# Altium schematic sheet ble_seismometer.SchDoc
size A; SheetNumber: 1; SheetTotal: 1
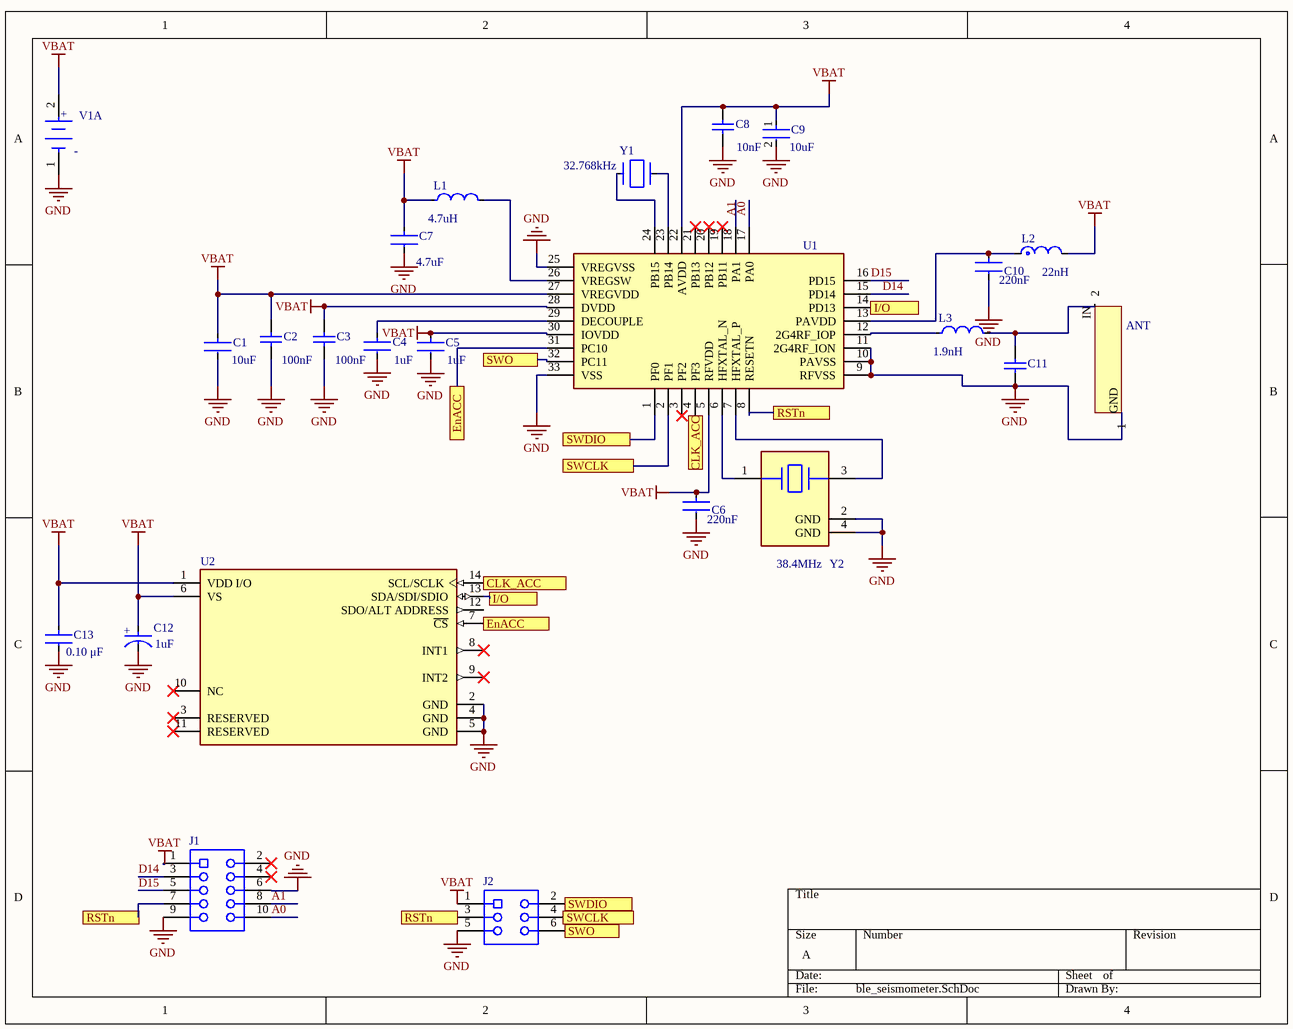
[diagram p0: ble_seismometer.SchDoc]

## Parts
ANT  Inverted F Antenna  [InvertedF-FOOTPRINT]  (value not drawn)  (net tie, no BOM)
C1  Capacitance: 10uF  [FP-C1608-080-0_1-MFG]  (hidden comment: C1608X5R1A106K080AC)
C2  Capacitance: 100nF  [CAPC1608X90X35ML10T15]  (hidden comment: GRM188R71H104KA93D)
C3  Capacitance: 100nF  [CAPC1608X90X35ML10T15]  (hidden comment: GRM188R71H104KA93D)
C4  Capacitance: 1uF  [FP-C0402C105K8PACTU-MFG]  (hidden comment: C0402C105K8PACTU)
C5  Capacitance: 1uF  [FP-C0402C105K8PACTU-MFG]  (hidden comment: C0402C105K8PACTU)
C6  Capacitance: 220nF  [FP-GRM188-0_1-e0_2_0_5-IPC_C]  (hidden comment: GRM188R71E224KA88D)
C7  Capacitance: 4.7uF  [FP-GRM188-0_1-MFG]  (hidden comment: GRM188R60J475KE19D)
C8  Capacitance: 10nF  [CAPC1608X90X35ML10T15]  (hidden comment: GRM188R71H103KA01D)
C9  Capacitance: 10uF  [FP-GRM188-0_1-e0_2_0_55-IPC_A]  (hidden comment: GRM188R60J106ME47D)
C10  Capacitance: 220nF  [FP-GRM188-0_1-e0_2_0_5-IPC_C]  (hidden comment: GRM188R71E224KA88D)
C11  VJ0603D1R5BXPAJ  [CAPC1608X92X38ML15T08]  (value not drawn)
C12  value 1uF  [FP-F98M-MFG]  (hidden comment: F981E105MMA)
C13  value 0.10 μF  [FP-C0603C-CF-MFG]  (hidden comment: C0603C104K5RACTU)
J1  61301021821  [61301021821]  (value not drawn)
J2  62000621821  [62000621821]  (value not drawn)
L1  Inductance: 4.7uH  [FP-LQM18FN_00-IPC_A]  (hidden comment: LQM18FN4R7M00D)
L2  Inductance: 22nH  [FP-LQG18HH_00-IPC_C]  (hidden comment: LQG18HN22NJ00D)
L3  Inductance: 1.9nH  [FP-LQW03AW_00-MFG]  (hidden comment: LQW03AW1N9C00D)
U1  EFR32BG13P632F512GM32-D  [EFR32BG13P632F512GM32-D]  (value not drawn)
U2  ADXL345BCCZ-RL7  [FP-CC-14-1-MFG]  (value not drawn)
V1  1013  [FP-1013-MFG]  (value not drawn)  (part A of 2)
Y1  Frequency: 32.768kHz  [FP-ABS05-MFG]  (hidden comment: ABS05-32.768KHZ-T)
Y2  Frequency: 38.4MHz  [FP-ABM10-165-MFG]  (hidden comment: ABM10-165-38.400MHZ-T3)

## Ports
CLK_ACC (see ble_seismometer[2C]), CLK_ACC (see ble_seismometer[3B]), EnACC (see ble_seismometer[2B]), EnACC (see ble_seismometer[2C]), I/O (see ble_seismometer[2C]), I/O (see ble_seismometer[3B]), RSTn (see ble_seismometer[1D], ble_seismometer[2D]), RSTn (see ble_seismometer[1D], ble_seismometer[3B]), RSTn (see ble_seismometer[2D], ble_seismometer[3B]), SWCLK (see ble_seismometer[2B]), SWCLK (see ble_seismometer[2D]), SWDIO (see ble_seismometer[2B]), SWDIO (see ble_seismometer[2D]), SWO (see ble_seismometer[2B]), SWO (see ble_seismometer[2D])

## Nets
GND: ANT.GND(1) C1.1 C2.1 C3.1 C4.2 C5.2 C6.2 C7.1 C8.1 C9.2 C10.2 C11.1 C12.1(C) C13.2 J1.6 J1.9 J2.5 U1.9(RFVSS) U1.10(PAVSS) U1.11(2G4RF_ION) U1.25(VREGVSS) U1.33(VSS) U2.2(GND) U2.4(GND) U2.5(GND) V1.1(1_CATHODE) Y2.2(GND) Y2.4(GND)
VBAT: C1.2 C2.2 C3.2 C5.1 C6.1 C7.2 C8.2 C9.1 C12.2(A) C13.1 J1.1 J2.1 L1.1 L2.2 U1.5(RFVDD) U1.22(AVDD) U1.27(VREGVDD) U1.28(DVDD) U1.30(IOVDD) U2.1(VDD_I/O) U2.6(VS) V1.2(1_ANODE)
A0: J1.10 U1.17(PA0)
A1: J1.8
CLK_ACC: U1.4(PF3) U2.14(SCL/SCLK) ; port CLK_ACC
D14: J1.3 U1.15(PD14)
D15: J1.5 U1.16(PD15)
EnACC: U1.31(PC10) U2.7(~{CS}) ; port EnACC
I/O: U1.14(PD13) U2.13(SDA/SDI/SDIO) ; port I/O
RSTn: J2.3 U1.8(RESETN) ; port RSTn
SWCLK: U1.2(PF1) ; port SWCLK
SWDIO: J2.2 U1.1(PF0) ; port SWDIO
SWO: J2.6 U1.32(PC11) ; port SWO
NetANT_IN: ANT.IN(2) C11.2 L3.2
NetC4_1: C4.1 U1.29(DECOUPLE)
NetC10_1: C10.1 L2.1 U1.13(PAVDD)
NetL1_2: L1.2 U1.26(VREGSW)
NetL3_1: L3.1 U1.12(2G4RF_IOP)
NetU1_6: U1.6(HFXTAL_N) Y2.1(1_Crystal)
NetU1_7: U1.7(HFXTAL_P) Y2.3(2_Crystal)
NetU1_23: U1.23(PB14) Y1.2
NetU1_24: U1.24(PB15) Y1.1

Not connected (* = marked no-connect by the designer): J1 2* 4* 7; J2 4; U1 3(PF2)* 18(PA1) 19(PB11)* 20(PB12)* 21(PB13)*; U2 3(RESERVED)* 8(INT1)* 9(INT2)* 10(NC)* 11(RESERVED)* 12(SDO/ALT_ADDRESS)

## Notes on the sheet
- Labels drawn without touching a wire or pin: A1
- (in symbol CMP-04424-000025-1) +
- (in symbol CMP-19636-000024-1, part A) +

## Library data of the parts
ANT = InvertedF
C1 = CMP-2000-04979-3: Multilayer Ceramic Capacitors 10μF ±10% 10V X5R SMD 0603; Dielectric Material: Ceramic; Construction: Flat; Height: 0.8mm; Thickness: 0.035inch; Case Code (Metric): 1608; Radiation Hardening: No; Number of Pins: 2; Voltage Rating (DC): 10V; Depth: 0.8mm; Voltage: 10V; RoHS Compliant: Yes; Voltage Rating: 10V; Package Quantity: 1; Resistor Type: Ceramic; Termination: SMD/SMT; Lead Free: Lead Free; REACH SVHC: No SVHC; Tolerance: 10%; Mount: Surface Mount; Series: C; Packaging: Tape and Reel; Width: 0.8mm; Dielectric: X5R; Weight: 7.1E-05oz; Length: 1.6mm; Max Operating Temperature: 85°C; Case Code (Imperial): 0603; Case/Package: 0603; Min Operating Temperature: -55°C
C2 C3 = CMP-2100-03643-1: Chip Capacitor, 0.1 uF, +/- 10%, 50 V, -55 to 125 degC, 0603 (1608 Metric), RoHS, Tape and Reel; Manufacturer: Murata; Dielectric Material: Ceramic; Voltage Rating: 50V; Dielectric: X7R; Insulation Resistance: 10GR; Case Code (Metric): 1608; Lead Free: LeadFree; Depth: 0.8mm; Number of Pins: 2; Radiation Hardening: No; Case/Package: 0603; Manufacturer URL: http://www.murata.com/; Packaging: TapeandReel; Length: 1.6mm; Contact Plating: Tin; Datasheet URL: http://psearch.en.murata.com/capacitor/product/GRM188R71H104KA93%23.pdf; Tolerance: 10%; Case Code (Imperial): 0603; Min Operating Temperature: -55degC; RoHSCompliant: true; Voltage: 50V; Termination: SMD/SMT; Mount: SurfaceMount; Material: Ceramic; Package Quantity: 1; Height: 0.8mm; Thickness: 0.035inch; REACH SVHC: NoSVHC; Max Operating Temperature: 125degC; Width: 0.8mm; Package Reference: 0603; Voltage Rating (DC): 50V; Datasheet Version: 42675.0; Package Description: 2-Pin Surface Mount Device, Body 1.6 x 0.8 mm
C4 C5 = CMP-2008-02081-2: CAP CER 1UF 10V X5R 0402; Dielectric Material: Ceramic; Dissipation Factor: 5%; Tolerance: 10%; Number of Pins: 2; Contact Plating: Tin; Min Operating Temperature: -55°C; Termination: SMD/SMT; Lead Free: Lead Free; Construction: Flat; Voltage Rating (DC): 10V; Mount: Surface Mount; Series: C; Thickness: 0.022inch; Width: 0.5mm; Radiation Hardening: No; Dielectric: X5R; Height: 0.5mm; Voltage: 10V; Length: 1mm; Depth: 0.5mm; Max Operating Temperature: 85°C; Package Quantity: 1; Packaging: Tape and Reel; RoHS Compliant: Yes; Case Code (Imperial): 0402; Case Code (Metric): 1005; REACH SVHC: No SVHC; Voltage Rating: 10V; Case/Package: 0402
C6 C10 = CMP-1035-02648-3: Chip Multilayer Ceramic Capacitors for General Purpose, 0603, 0.22uF, X7R, 15%, 10%, 25V; Voltage: 50V; Number of Pins: 2; Length: 1.6mm; Material: Ceramic; Depth: 0.8mm; REACH SVHC: No SVHC; Voltage Rating (DC): 25V; Tolerance: 10%; Max Operating Temperature: 125°C; Lead Free: Lead Free; Package Quantity: 1; Voltage Rating: 25V; Width: 0.8mm; Case Code (Metric): 1608; Min Operating Temperature: -55°C; Case/Package: 0603; Mount: Surface Mount; Dielectric: X7R; Height: 0.8mm; Termination: SMD/SMT; Radiation Hardening: No; Case Code (Imperial): 0603; Thickness: 0.035inch; Packaging: Tape and Reel
C7 = CMP-2006-02799-3: CAP CER 4.7UF 6.3V X5R 0603; Material: Ceramic; Tolerance: 10%; Max Operating Temperature: 85°C; REACH SVHC: No SVHC; Thickness: 0.035inch; Voltage Rating: 6.3V; Package Quantity: 1; Radiation Hardening: No; Voltage: 6.3V; Case Code (Metric): 1608; Dielectric: X5R; Mount: Surface Mount; RoHS Compliant: Yes; Height: 0.8mm; Voltage Rating (DC): 6.3V; Width: 0.8mm; Lead Free: Lead Free; Case Code (Imperial): 0603; Packaging: Tape and Reel; Length: 1.6mm; Case/Package: 0603; Termination: SMD/SMT; Min Operating Temperature: -55°C; Depth: 0.8mm
C8 = CMP-2100-03642-1: Chip Capacitor, 10 nF, +/- 10%, 50 V, -55 to 125 degC, 0603 (1608 Metric), RoHS, Tape and Reel; Manufacturer: Murata; Insulation Resistance: 10GR; Dielectric: X7R; Voltage Rating: 50V; Material: Ceramic; Package Quantity: 1; Lead Free: LeadFree; Case/Package: 0603; Termination: SMD/SMT; REACH SVHC: Unknown; Manufacturer URL: http://www.murata.com/; Datasheet URL: http://search.murata.co.jp/Ceramy/image/img/A01X/G101/ENG/GRM188R71H103KA01-01.pdf; Mount: SurfaceMount; Datasheet Version: 42401.0; Number of Pins: 2; Length: 1.6mm; Voltage: 50V; Depth: 0.8mm; Tolerance: 10%; Min Operating Temperature: -55degC; Voltage Rating (DC): 50V; Max Operating Temperature: 125degC; Package Description: 2-Pin Surface Mount Device, Body 1.6 x 0.8 mm; RoHSCompliant: True; Case Code (Imperial): 0603; Width: 0.031inch; Case Code (Metric): 1608; Height: 0.8mm; Package Reference: 0603; Packaging: TapeandReel; Thickness: 0.035inch; Dielectric Material: Ceramic
C9 = CMP-2006-02792-2: Chip Multilayer Ceramic Capacitors for General Purpose, 0603, 10uF, X5R, 15%, 20%, 6.3V; Packaging: Tape and Reel; Voltage Rating (DC): 6.3V; Width: 0.031inch; Termination: SMD/SMT; Dielectric: X5R; Package Quantity: 4000; Voltage Rating: 6.3V; Case/Package: 0603; Min Operating Temperature: -55°C; Voltage: 6.3V; Length: 1.6mm; Thickness: 0.035inch; Lead Free: Lead Free; Depth: 0.8mm; Case Code (Imperial): 0603; Max Operating Temperature: 85°C; Material: Ceramic; Height: 0.8mm; Tolerance: 20%; Mount: Surface Mount; REACH SVHC: No SVHC; Radiation Hardening: No; Case Code (Metric): 1608
C11 = CMP-2006-01499-1: Manufacturer: Vitramon; Part Number: VJ0603D1R5BXPAJ
C12 = CMP-04424-000025-1: CAP TANT 1UF 20% 25V 0603; Manufacturer: AVX; Description: 1µF Molded Tantalum Capacitors 25V 0603 (1608 Metric) 10Ohm; Ripple Current: 50mA; Life: 1000Hours; Esr: 10Ω; Dissipation Factor: 8%; Material: Tantalum; Leakage Current: 0.5uA; Temperature Coefficient: 30%; Device Class L3: Tantalum Capacitors; Mouser Description: Tantalum Capacitors - Solid SMD 1uF 25V 20% 0603,1.6x0.85x0.65mm; Temperature Range High: +125°C; Voltage Rating: 25V; Digikey Description: CAP TANT 1UF 20% 25V 0603; Device Class L1: Passive Components; Octopart: https://octopart.com/f981e105mma-avx-27552246; Automotive: No; Footprint Url: https://www.avx.com/download/software/literature/AVX-Footprint-Library.pdf; ComponentLink2URL: http://datasheets.avx.com/F98.pdf; Temperature: -55°C to +125°C; Package: F98M; Manufacturer Part Number: F981E105MMA; Capacitance: 1uF; Lead Free: Yes; ComponentLink2Description: Datasheet; Tolerance: 20%; Height: 0.9mm; Device Class L2: Capacitors; Category: Cap; Temperature Range Low: -55°C; RoHS: TRUE
C13 = CMP-2006-03061-2: CAP CER 0.1UF 50V X7R 0603; Manufacturer: KEMET; Tolerance: 0.1; Description: C0603 0.10 μF X7R 30ppm/°C 10.00% 50 V; Temperature Coefficient: 30ppm/°C; Material: Ceramic; Automotive Grade: Grade 1; Temperature: -55°C to +125°C; RoHS: TRUE; Temperature Range High: +125°C; Lead Free: Yes; Octopart: https://octopart.com/c0603c104k5ractu-kemet-139244; Digikey Description: CAP CER 0.1UF 50V X7R 0603; Category: Cap; Package: C0603C-CF; ComponentLink2Description: Datasheet; Temperature Range Low: -55°C; Device Class L1: Passive Components; Voltage Rating: 50 V; Automotive: Yes; Device Class L3: Ceramic Capacitors; ComponentLink2URL: https://api.kemet.com/component-edge/download/datasheet/C0603C100J5GACAUTO.pdf; Capacitance: 0.10 μF; Device Class L2: Capacitors; Manufacturer Part Number: C0603C104K5RACTU; Temperature Characteristic: X7R; Height: 0.87mm
J1 = CMP-1502-01334-1: THT Vertical Socket Header WR-PHD, Pitch 2.54 mm, Dual Row, 10 pins; Manufacturer: Wurth Elektronik; Rated Current: 3A; Gender: Female; Pin Number: 10; Pitch: 2.54mm; Contact Resistance: 20mOhm; Withstanding Voltage: 500VAC; Working Voltage: 250VAC; Publisher: WurthElektronik; Datasheet URL: https://katalog.we-online.de/em/datasheet/6130xx21821.pdf; Operating Temperature: -40to125degC; Packaging: Tray; Orientation: Vertical; Mounting Technology: THT; Package Reference: 61301021821; Manufacturer URL: http://www.we-online.de; Row Number: Dual; Part Number: 61301021821
J2 = CMP-1502-01207-1: THT Vertical Socket Header WR-PHD, Pitch 2.00 mm, Dual Row, 6 pins; Manufacturer: Wurth Elektronik; Rated Current: 2A; Gender: Female; Pitch: 2.00mm; Working Voltage: 250VAC; Withstanding Voltage: 500VAC; Pin Number: 6; Contact Resistance: 20mOhm; Row Number: Dual; Manufacturer URL: http://www.we-online.de; Datasheet URL: https://katalog.we-online.de/em/datasheet/62000621821.pdf; Publisher: WurthElektronik; Operating Temperature: -40to105degC; Packaging: Tube; Package Reference: 62000621821; Part Number: 62000621821; Orientation: Vertical; Mounting Technology: THT
L1 = CMP-06042-016387-1: FIXED IND 4.7UH 80MA 600 MOHM; Self Resonant Frequency: 50MHz; Core Material: Ferrite; DC Resistance (DCR): 600mR; Test Frequency: 1MHz; Shielding: Shielded; Tolerance: 20%; Max DC Current: 80mA; Width: 0.031inch; RoHS Compliant: Yes; Packaging: Tape and Reel; Case Code (Metric): 1608; Weight: 7.1E-05oz; Lead Free: Lead Free; DC Current: 80mA; Height - Seated (Max): 0.035inch; Rated Current-Max: 80mA; Max Operating Temperature: 125°C; Height: 0.8mm; Radiation Hardening: No; Current Rating: 80mA; Package Quantity: 4000; Case Code (Imperial): 0603; Case/Package: 0603; Termination: SMD/SMT; Min Operating Temperature: -55°C; Mount: Surface Mount; Series: LQM18F; Saturation Current: 80mA; Depth: 0.9mm; Military Standard: Not; Length: 1.6mm
L2 = CMP-06042-016460-1: Multilayer type RF Inductor 22nH ±5% 0.5Ω 500mA 0603; Current Rating: 300mA; Core Material: Air; Shielding: Unshielded; Self Resonant Frequency: 2.3GHz; Test Frequency: 100MHz; Q Factor: 12; DC Resistance (DCR): 500mR; Max Operating Temperature: 85°C; RoHS Compliant: Yes; Termination: SMD/SMT; Max DC Current: 300mA; Min Operating Temperature: -40°C; Height - Seated (Max): 0.037inch; Length: 1.6mm; REACH SVHC: No SVHC; Package Quantity: 4000; Tolerance: 5%; Depth: 0.95mm; Mount: Surface Mount; Packaging: Tape and Reel; Military Standard: Not; DC Current: 300mA; Case Code (Metric): 1608; Lead Free: Lead Free; Case Code (Imperial): 0603; Inductance Tolerance: 5%; Width: 0.031inch; Case/Package: 0603; Height: 0.8mm; Radiation Hardening: No; Series: LQG18H
L3 = CMP-06042-002256-1: Wire Wound RF Inductor 1.9nH ±0.2nH 620mA 0.08Ω 0201 (0603); Self Resonant Frequency: 19GHz; Test Frequency: 100MHz; DC Resistance (DCR): 80mR; Shielding: Unshielded; Packaging: Tape and Reel; Mount: Surface Mount; Min Operating Temperature: -55°C; Resistor Type: Wirewound; Max Operating Temperature: 125°C; Case/Package: Nonstandard; Current Rating: 620mA
U1 = EFR32BG13P632F512GM32-D: RF System on a Chip - SoC Blue Gecko BLE SoC QFN48 2.4 G 10 dB BLE/proprietary 512 kB 64 kB (RAM) 16GPIO; Manufacturer_Name: Silicon Labs; Geometry.Height: 0.9mm; Mouser Part Number: 634-BGP632F512GM32D; Mouser Price/Stock: https://www.mouser.co.uk/ProductDetail/Silicon-Labs/EFR32BG13P632F512GM32-D?qs=EBDBlbfErPzhsDxvdSLfmw%3D%3D; Manufacturer_Part_Number: EFR32BG13P632F512GM32-D; Datasheet Link: https://www.silabs.com/documents/public/data-sheets/efr32bg13-datasheet.pdf
U2 = CMP-0885-00033-2: ACCEL 2-16G I2C/SPI 14LGA; Bandwidth: 0.05Hz; Nominal Supply Current: 140uA; Operating Supply Current: 145uA; -3db Bandwidth: 1.6kHz; Axis: X, Y, Z; Sensitivity: 256LSB/g; Output Type: Digital; Min Supply Voltage: 2V; Max Supply Voltage: 3.6V; Radiation Hardening: No; Number of Pins: 14; Length: 5mm; Package Quantity: 1; Max Operating Temperature: 85°C; Packaging: Tape and Reel; Min Operating Temperature: -40°C; Case/Package: LGA; Depth: 3mm; Lead Free: Contains Lead
V1 = CMP-19636-000024-1: BATTERY HOLDER AA 2 CELL PC PIN; Number of Cells: 2; Series: -; Material: Nylon; Termination: PC Pin; Color: Black; Lead Free: Lead Free; Package Quantity: 1; REACH SVHC: No SVHC; Mount: Through Hole; Max Operating Temperature: 145°C; Packaging: Tray; Number of Batteries: 2; Contact Plating: Nickel; Min Operating Temperature: -50°C
Y1 = CMP-27762-008890-2: Crystal 32.768kHz ±20ppm (Tol) 12.5pF FUND 90kΩ 2-Pin SMD T/R; Series Resistance: 90kR; Length: 1.6mm; Package Quantity: 3000; Packaging: Tape and Reel; Max Operating Temperature: 85°C; Lead Free: Lead Free; Tolerance: 20ppm; Termination: SMD/SMT; REACH SVHC: No SVHC; Width: 1mm; Min Operating Temperature: -40°C; RoHS Compliant: Yes; Case/Package: CSMD; ESR (Equivalent Series Resistance): 90kR; Number of Pins: 2; Height: 0.5mm; Series: ABS05; Load Capacitance: 12.5pF; Frequency Tolerance: 20ppm; Depth: 1mm; Operating Frequency: 32.768 kHz; Mount: Surface Mount; Radiation Hardening: No
Y2 = CMP-27762-010013-1: CRYSTAL 38.4000MHZ 10PF SMD; ESR (Equivalent Series Resistance): 40R; Frequency Stability: 20ppm; Min Operating Temperature: -30°C; Width: 0.079inch; Load Capacitance: 10pF; Packaging: Tape and Reel; Length: 0.098inch; Height: 0.02inch; Case/Package: SMD/SMT; RoHS Compliant: Yes; Mount: Surface Mount; Max Operating Temperature: 85°C